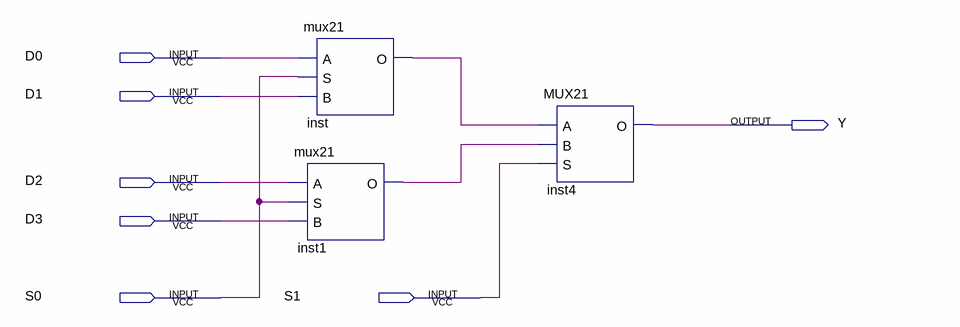
[diagram p0: schematic sheet]
// Quartus schematic mux41.bdf as structural Verilog: 3 symbols, 7 pins
module mux41 (
  input  D0,
  input  D1,
  input  D2,
  input  D3,
  input  S0,
  input  S1,
  output Y
);

  wire inst1_o, inst_o;

  mux21 inst (.A(D0), .S(S0), .B(D1), .O(inst_o));
  mux21 inst1 (.A(D2), .S(S0), .B(D3), .O(inst1_o));
  MUX21 inst4 (.A(inst_o), .S(S1), .B(inst1_o), .O(Y));
endmodule
